# Altium schematic sheet 01_Power.SchDoc
size A4; SheetNumber: 3; SheetTotal: 6
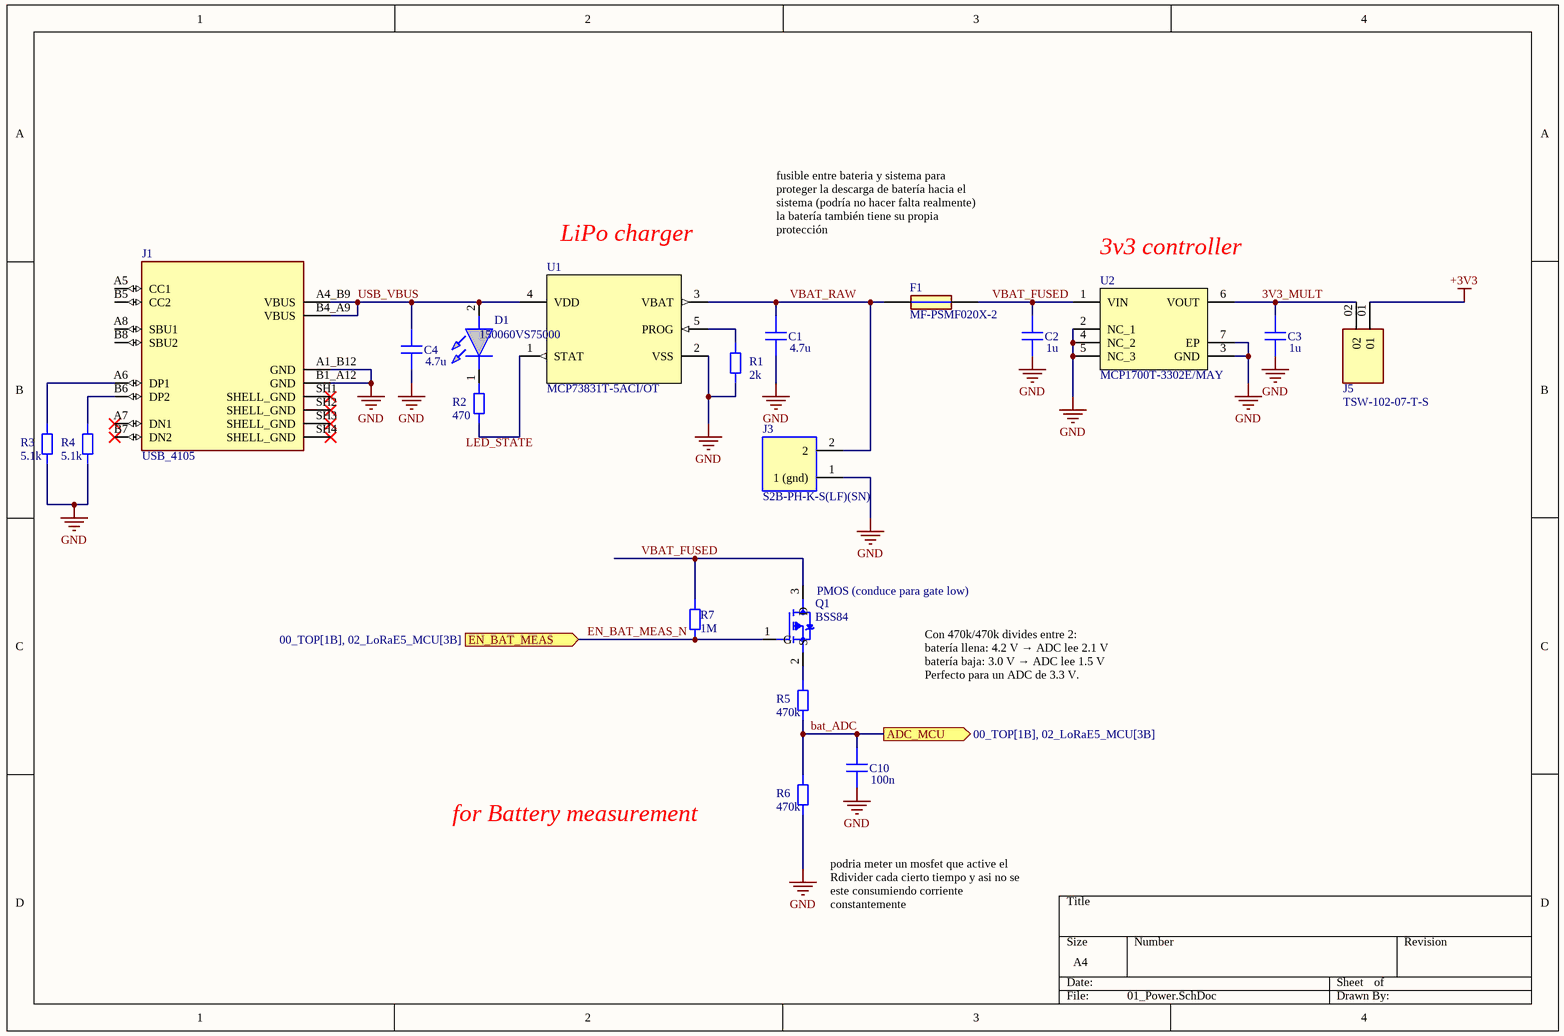
[diagram p0: 01_Power.SchDoc]

## Parts
C1  4.7u  [Capacitor_SMD:0603_1608m]
C2  1u  [Capacitor_SMD:0603_1608m]
C3  1u  [Capacitor_SMD:0603_1608m]
C4  4.7u  [Capacitor_SMD:0603_1608m]
C10  100n  [Capacitor_SMD:0603_1608m]
D1  150060VS75000  [LEDC1608X70N]
F1  MF-PSMF020X-2  [MF-PSMF020X-2]
J1  USB_4105  [USB4105-GF-A]
J3  S2B-PH-K-S(LF)(SN)  [S2B-PH-K-S(LF)(SN)]
J5  TSW-102-07-T-S  [TSW-102-07-T-S]
Q1  BSS84  [BS884]
R1  2k  [Resistor_SMD:0603_1608m]
R2  470  [Resistor_SMD:0603_1608m]
R3  5.1k  [Resistor_SMD:0603_1608m]
R4  5.1k  [Resistor_SMD:0603_1608m]
R5  470k  [Resistor_SMD:0603_1608m]
R6  470k  [Resistor_SMD:0603_1608m]
R7  1M  [Resistor_SMD:0603_1608m]
U1  MCP73831T-5ACI/OT  [MCP73831T-5ACI/OT]
U2  MCP1700T-3302E/MAY  [MCP1700T-3302E/MAY]

## Ports
ADC_MCU (out, see 00_TOP[1B], 02_LoRaE5_MCU[3B]), EN_BAT_MEAS (in, see 00_TOP[1B], 02_LoRaE5_MCU[3B])

## Nets
+3V3: J5.01
GND: C1.2 C2.2 C3.2 C4.2 C10.2 J1.A1_B12(GND) J1.B1_A12(GND) J3.1(1_(gnd)) R1.2 R3.2 R4.2 R6.2 U1.2(VSS) U2.2(NC_1) U2.3(GND) U2.4(NC_2) U2.5(NC_3) U2.7(EP)
3V3_MULT: C3.1 J5.02 U2.6(VOUT)
bat_ADC: C10.1 R5.2 R6.1 ; port ADC_MCU
EN_BAT_MEAS_N: Q1.1(G) R7.1 ; port EN_BAT_MEAS
USB_VBUS: C4.1 D1.2(A) J1.A4_B9(VBUS) J1.B4_A9(VBUS) U1.4(VDD)
VBAT_FUSED: C2.1 F1.2 Q1.3(D) R7.2 U2.1(VIN)
VBAT_RAW: C1.1 F1.1 J3.2 U1.3(VBAT)
NetD1_1: D1.1(K) R2.1
NetJ1_A6: J1.A6(DP1) R3.1
NetJ1_B6: J1.B6(DP2) R4.1
NetQ1_2: Q1.2(S) R5.1
NetR1_1: R1.1 U1.5(PROG)
NetR2_2: R2.2 U1.1(STAT)

Not connected (* = marked no-connect by the designer): J1 A5(CC1) A7(DN1)* A8(SBU1) B5(CC2) B7(DN2)* B8(SBU2) SH1(SHELL_GND)* SH2(SHELL_GND)* SH3(SHELL_GND)* SH4(SHELL_GND)*

## Notes on the sheet
- LiPo charger
- fusible entre bateria y sistema para proteger la descarga de batería hacia el sistema (podría no hacer falta realmente) la batería también tiene su propia protección
- (near U2) 3v3 controller
- (near Q1) PMOS (conduce para gate low)
- Con 470k/470k divides entre 2:
  batería llena: 4.2 V → ADC lee 2.1 V
  batería baja: 3.0 V → ADC lee 1.5 V
  Perfecto para un ADC de 3.3 V.
- for Battery measurement
- podria meter un mosfet que active el Rdivider cada cierto tiempo y asi no se este consumiendo corriente constantemente
- Labels drawn without touching a wire or pin: LED_STATE

## Library data of the parts
C1-C4 C10 = Generic_Capacitor
D1 = 150060VS75000: WL-SMCW SMT Mono-Color Chip LED Waterclear 0603, Bright Green, Typ.(@20mA): 570nm, 40mcd, 2.0V, 140 AlInGaP; Manufacturer_Name: Wurth Elektronik; Geometry.Height: 0.7mm; Manufacturer_Part_Number: 150060VS75000; Mouser Part Number: 710-150060VS75000; Mouser Price/Stock: https://www.mouser.co.uk/ProductDetail/Wurth-Elektronik/150060VS75000?qs=LlUlMxKIyB1Q1Bi5mQ%2FKLw%3D%3D; Arrow Part Number: *; Arrow Price/Stock: *; Datasheet Link: https://www.we-online.com/catalog/datasheet/150060VS75000.pdf
F1 = MF-PSMF020X-2: Manufacturer_Name: Bourns; Geometry.Height: 0.85mm; Manufacturer_Part_Number: MF-PSMF020X-2; Mouser Part Number: 652-MF-PSMF020X-2; Mouser Price/Stock: https://www.mouser.co.uk/ProductDetail/Bourns/MF-PSMF020X-2?qs=B2dI1vFk2x%2FnZ%252B%252BDoGvxDQ%3D%3D; Arrow Part Number: MF-PSMF020X-2; Arrow Price/Stock: https://www.arrow.com/en/products/mf-psmf020x-2/bourns?utm_currency=USD&region=europe; Datasheet Link: https://www.bourns.com/pdfs/mfpsmf.pdf
J5 = TSW-102-07-T-S: <a href="https://pricing.snapeda.com/parts/TSW-102-07-T-S/Samtec/view-part?ref=eda">Check availability</a>; MF: {'manufacturer': u'Samtec'}; Package: None; Price: None; Value: *; MP: TSW-102-07-T-S; Availability: Unavailable
Q1 = BSS84: P-Channel 50 V 130mA (Ta) 225mW (Ta) Surface Mount SOT-23-3 (TO-236); MF: onsemi; SnapEDA_Link: https://www.snapeda.com/parts/BSS84/Onsemi/view-part/?ref=snap; Package: None; Value: *; MP: BSS84; Check_prices: https://www.snapeda.com/parts/BSS84/Onsemi/view-part/?ref=eda
R1-R7 = Generic Resistor